# Altium project SMPS.PrjPcb
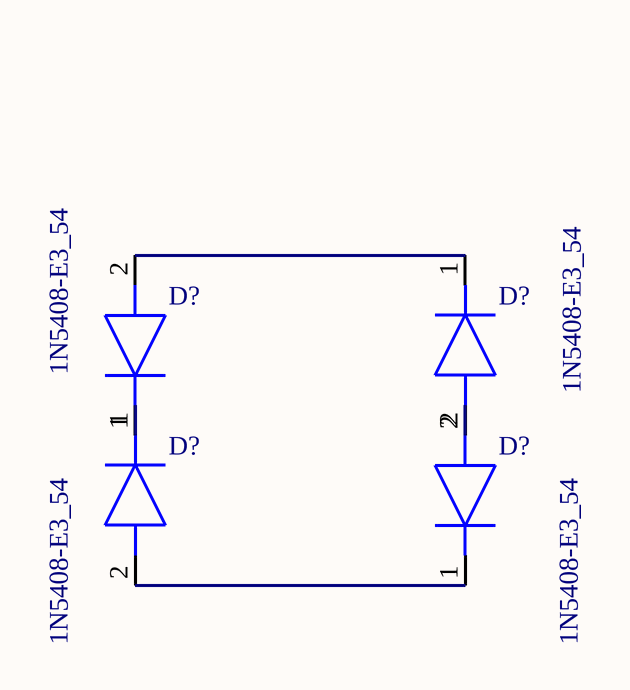
[diagram p0: SMPS.SchDoc]
1 sheet, 4 parts. Net scope: global (net labels, ports and power ports of the same name join across sheets).
Board file: SMPS.PcbDoc

## Sheet SMPS.SchDoc
size A4; SheetNumber: 1; SheetTotal: 1

### Parts
(Parts that share a designator on the sheet are numbered #1, #2 ... from top to bottom, then left to right.)
D?#1  1N5408-E3_54  [DIOAD2855W132L835D505]
D?#2  1N5408-E3_54  [DIOAD2855W132L835D505]
D?#3  1N5408-E3_54  [DIOAD2855W132L835D505]
D?#4  1N5408-E3_54  [DIOAD2855W132L835D505]

### Nets
NetD?#1_1: D?#1.1(K) D?#3.2(A)
NetD?#1_2: D?#1.2(A) D?#4.2(A)
NetD?#2_1: D?#2.1(K) D?#3.1(K)
NetD?#2_2: D?#2.2(A) D?#4.1(K)

### Library data of the parts
D?#1-D?#4 = 1N5408-E3_54: Diode; Manufacturer_Name: Vishay; Manufacturer_Part_Number: 1N5408-E3/54; Datasheet Link: https://www.vishay.com/docs/88516/1n5400.pdf; Mouser Part Number: 625-1N5408-E3; Mouser Price/Stock: https://www.mouser.co.uk/ProductDetail/Vishay-General-Semiconductor/1N5408-E3-54?qs=7w0fSgRKp90S1fAOemJGGg%3D%3D; Arrow Part Number: 1N5408-E3/54; Arrow Price/Stock: https://www.arrow.com/en/products/1n5408-e354/vishay